# Altium schematic sheet down_converter_IF2.SchDoc: DOWN IF2
size A3; DocumentNumber: 17; Revision: 0; SheetNumber: 17; SheetTotal: 19
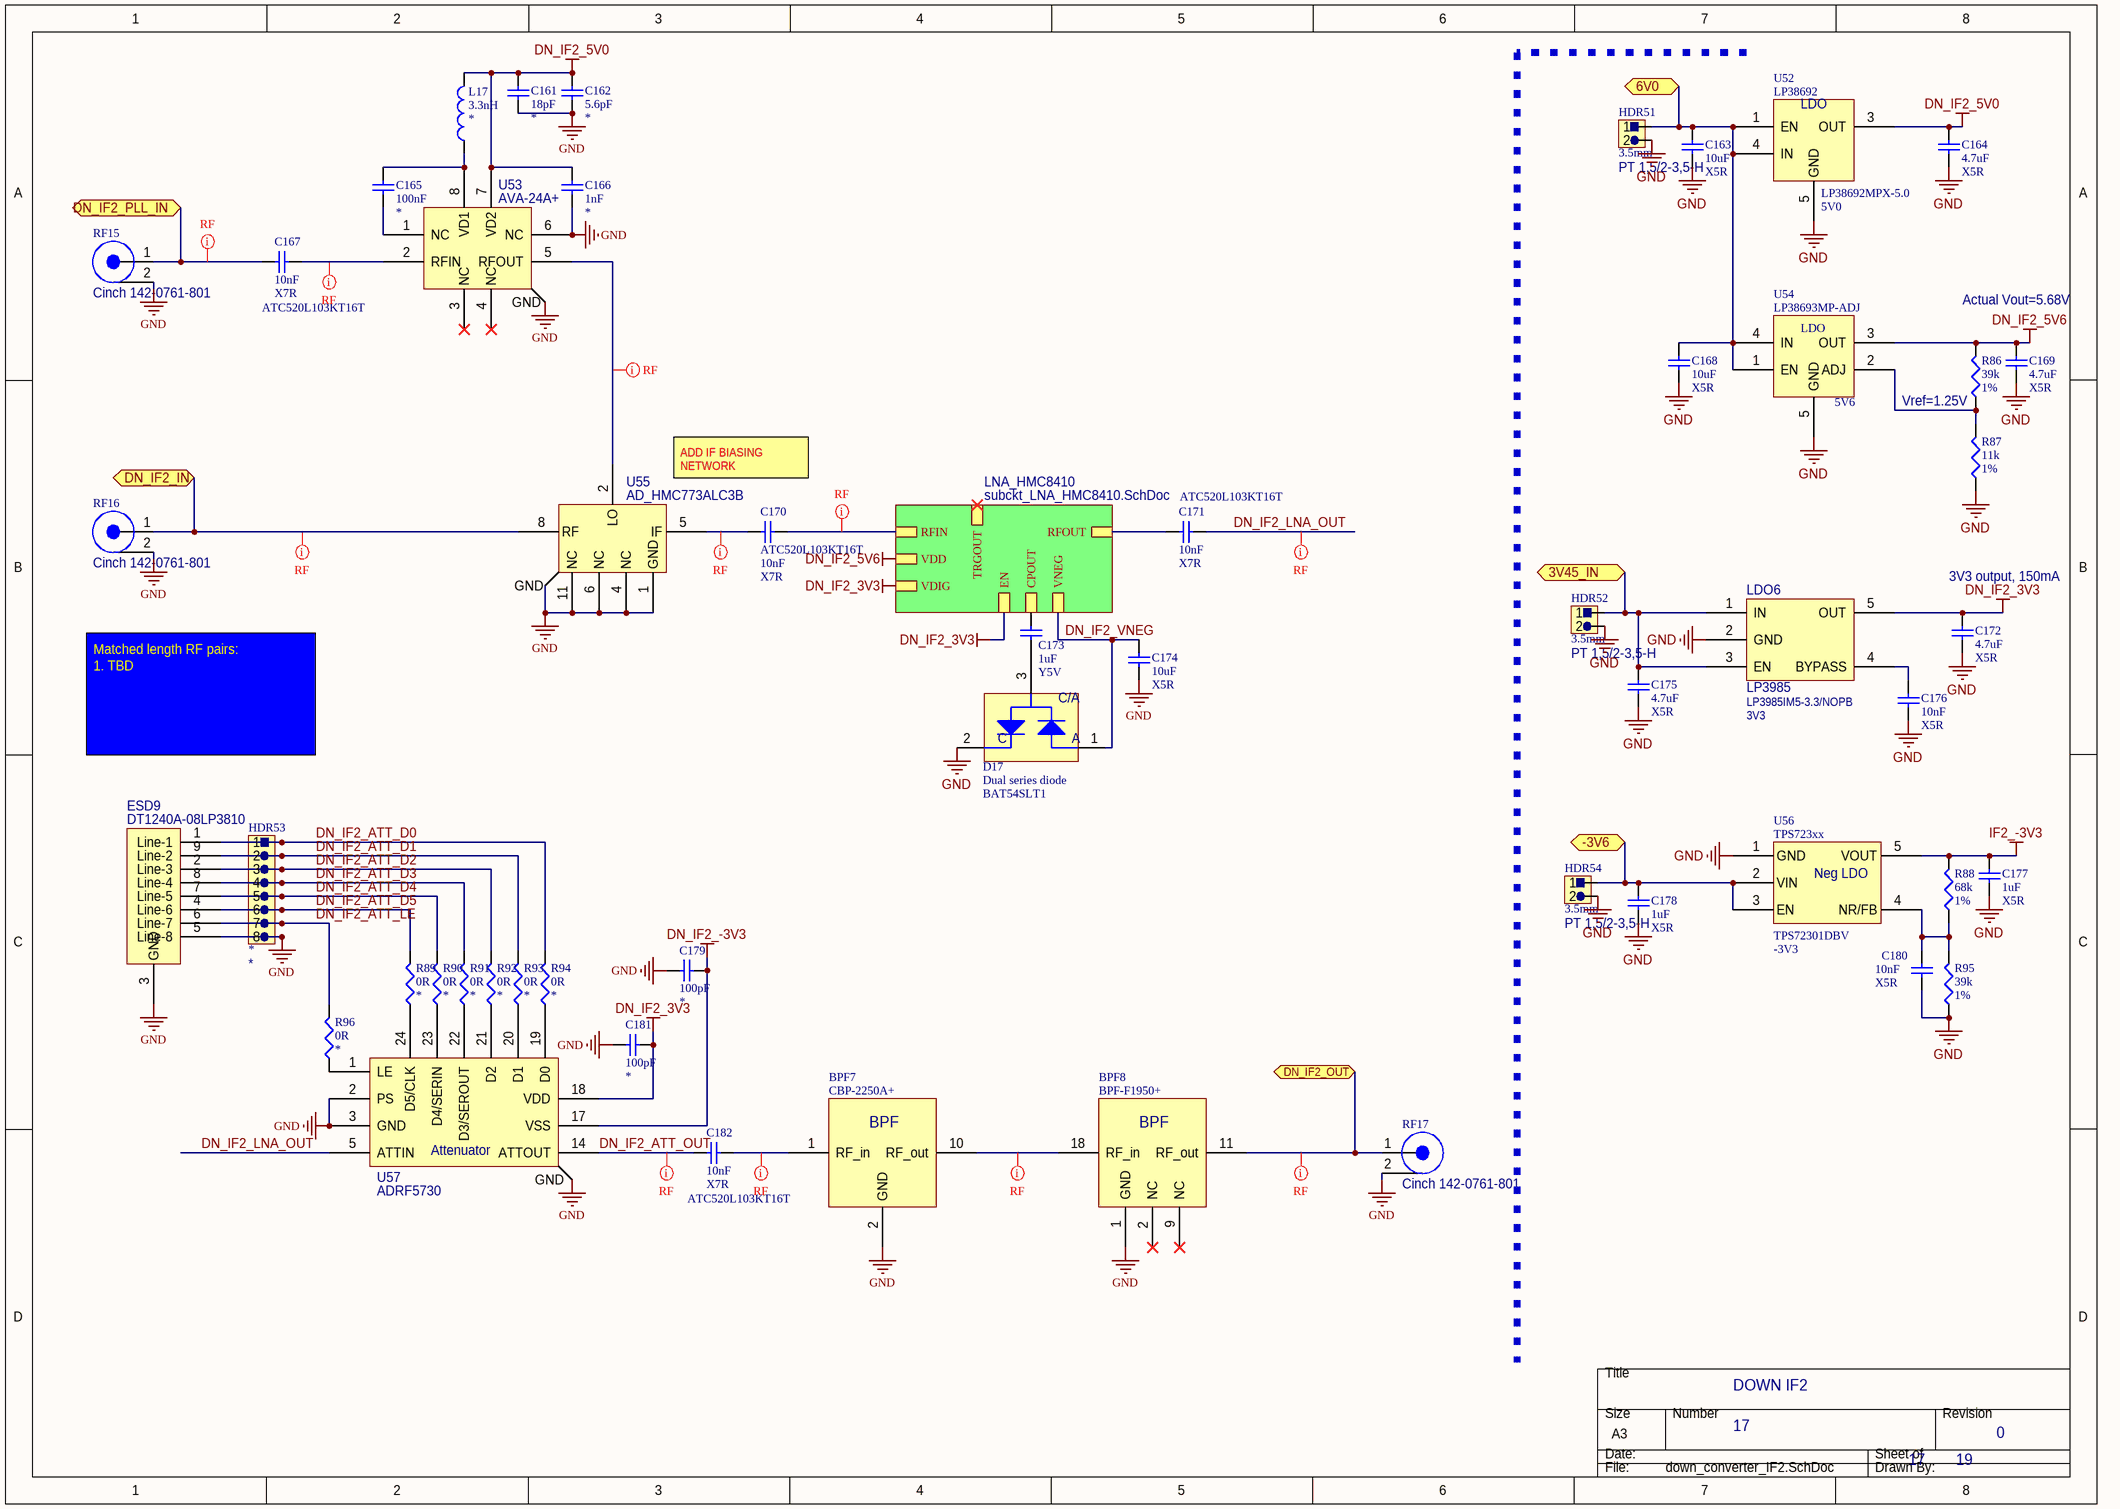
[diagram p0: down_converter_IF2.SchDoc]

## Parts
BPF7  CBP-2250A+
BPF8  BPF-F1950+
C161  value 18pF  [Model Name]  (hidden comment: Capacitor)
C162  value 5.6pF  [Model Name]  (hidden comment: Capacitor)
C163  value 10uF  Dielectric: X5R  [CAP0603]  (hidden comment: Capacitor)
C164  value 4.7uF  Dielectric: X5R  [TBD]  (hidden comment: Capacitor)
C165  value 100nF  [Model Name]  (hidden comment: Capacitor)
C166  value 1nF  [Model Name]  (hidden comment: Capacitor)
C167  ATC520L103KT16T  value 10nF  Dielectric: X7R  [TBD]
C168  value 10uF  Dielectric: X5R  [CAP0603]  (hidden comment: Capacitor)
C169  value 4.7uF  Dielectric: X5R  [CAP0603]  (hidden comment: Capacitor)
C170  ATC520L103KT16T  value 10nF  Dielectric: X7R  [TBD]
C171  ATC520L103KT16T  value 10nF  Dielectric: X7R  [TBD]
C172  value 4.7uF  Dielectric: X5R  [CAP0603]  (hidden comment: Capacitor)
C173  value 1uF  Dielectric: Y5V  [CAP0603]  (hidden comment: Capacitor)
C174  value 10uF  Dielectric: X5R  [CAP0603]  (hidden comment: Capacitor)
C175  value 4.7uF  Dielectric: X5R  [CAP0603]  (hidden comment: Capacitor)
C176  value 10nF  Dielectric: X5R  [CAP0603]  (hidden comment: Capacitor)
C177  value 1uF  Dielectric: X5R  [TBD]  (hidden comment: Capacitor)
C178  value 1uF  Dielectric: X5R  [CAP0603]  (hidden comment: Capacitor)
C179  value 100pF  [TBD]  (hidden comment: Capacitor)
C180  value 10nF  Dielectric: X5R  [TBD]  (hidden comment: Capacitor)
C181  value 100pF  [TBD]  (hidden comment: Capacitor)
C182  ATC520L103KT16T  value 10nF  Dielectric: X7R  [TBD]
D17  Dual series diode  Model: BAT54SLT1  [SOT23-3]
ESD9  DT1240A-08LP3810
HDR51  Pitch: 3.5mm  Model: PT 1,5/2-3,5-H  [JST ZH 2pin TH]  (hidden comment: Header 2 pins)
HDR52  Pitch: 3.5mm  Model: PT 1,5/2-3,5-H  [JST ZH 2pin TH]  (hidden comment: Header 2 pins)
HDR53  Header 8 pins  [TBD]  (value not drawn)
HDR54  Pitch: 3.5mm  Model: PT 1,5/2-3,5-H  [JST ZH 2pin TH]  (hidden comment: Header 2 pins)
L17  value 3.3nH  [TBD]  (hidden comment: Inductor)
LDO6  LP3985  Model: LP3985IM5-3.3/NOPB  Voltage: 3V3
R86  value 39k  Type: 1%  [RES0603]  (hidden comment: Resistor)
R87  value 11k  Type: 1%  [RES0603]  (hidden comment: Resistor)
R88  value 68k  Type: 1%  [RES0603]  (hidden comment: Resistor)
R89  value 0R  [RES0603]  (hidden comment: Resistor)
R90  value 0R  [RES0603]  (hidden comment: Resistor)
R91  value 0R  [RES0603]  (hidden comment: Resistor)
R92  value 0R  [RES0603]  (hidden comment: Resistor)
R93  value 0R  [RES0603]  (hidden comment: Resistor)
R94  value 0R  [RES0603]  (hidden comment: Resistor)
R95  value 39k  Type: 1%  [RES0603]  (hidden comment: Resistor)
R96  value 0R  [RES0603]  (hidden comment: Resistor)
RF15  Model: Cinch 142-0761-801  [TBD]  (hidden comment: RF connector w/ 2 pins)
RF16  Model: Cinch 142-0761-801  [TBD]  (hidden comment: RF connector w/ 2 pins)
RF17  Model: Cinch 142-0761-801  [TBD]  (hidden comment: RF connector w/ 2 pins)
U52  LP38692  Model: LP38692MPX-5.0  Voltage: 5V0  [TBD]
U53  AVA-24A+
U54  LDO  Model: LP38693MP-ADJ  Voltage: 5V6  [Model Name]
U55  AD_HMC773ALC3B
U56  TPS723xx  Model: TPS72301DBV  Voltage: -3V3  [TBD]
U57  ADRF5730

## Sub-sheets
LNA_HMC8410 = subckt_LNA_HMC8410.SchDoc: RFOUT, RFIN, VDD, EN, VDIG, CPOUT, VNEG, TRGOUT

## Ports
3V45_IN, 6V0, -3V6, DN_IF2_IN, DN_IF2_OUT, DN_IF2_PLL_IN

## Nets
DN_IF2_3V3: C172.2 C181.1 LDO6.5(OUT) U57.18(VDD) ; sheet LNA_HMC8410/EN, sheet LNA_HMC8410/VDIG
DN_IF2_5V0: C161.1 C162.1 C164.2 C166.1 L17.2 U52.3(OUT) U53.7(VD2)
DN_IF2_5V6: C169.2 R86.2 U54.3(OUT) ; sheet LNA_HMC8410/VDD
DN_IF2_-3V3: C179.1 U57.17(VSS)
GND: BPF7.2(GND) BPF7.3 BPF7.4 BPF7.5 BPF7.6 BPF7.7 BPF7.8 BPF7.9 BPF7.11 BPF7.12 BPF7.13 BPF7.14 BPF7.15 BPF7.16 BPF8.1(GND) BPF8.3 BPF8.4 BPF8.5 BPF8.6 BPF8.7 BPF8.8 BPF8.10 BPF8.12 BPF8.13 BPF8.14 BPF8.15 BPF8.16 BPF8.17 C161.2 C162.2 C163.1 C164.1 C166.2 C168.1 C169.1 C172.1 C174.1 C175.1 C176.1 C177.1 C178.1 C179.2 C180.1 C181.2 D17.2(C) ESD9.3(GND) ESD9.5(Line-8) HDR51.2 HDR52.2 HDR53.8 HDR54.2 LDO6.2(GND) R87.1 R95.1 RF15.2 RF16.2 RF17.2 U52.5(GND) U53.6(NC) U53.9(GND) U54.5(GND) U55.1(GND) U55.3(GND) U55.4(NC) U55.6(NC) U55.7(GND) U55.9(GND) U55.10(GND) U55.11(NC) U55.12(GND) U55.13(GND) U56.1(GND) U57.2(PS) U57.3(GND) U57.4(GND) U57.6(GND) U57.7(GND) U57.8(GND) U57.9(GND) U57.10(GND) U57.11(GND) U57.12(GND) U57.13(GND) U57.15(GND) U57.16(GND) U57.25(GND)
IF2_-3V3: C177.2 R88.2 U56.5(VOUT)
3V45_IN: C175.2 HDR52.1 LDO6.1(IN) LDO6.3(EN) ; port 3V45_IN
6V0: C163.2 C168.2 HDR51.1 U52.1(EN) U52.4(IN) U54.1(EN) U54.4(IN) ; port 6V0
-3V6: C178.2 HDR54.1 U56.2(VIN) U56.3(EN) ; port -3V6
DN_IF2_ATT_D0: ESD9.1(Line-1) HDR53.1 R94.2
DN_IF2_ATT_D1: ESD9.9(Line-2) HDR53.2 R93.2
DN_IF2_ATT_D2: ESD9.2(Line-3) HDR53.3 R92.2
DN_IF2_ATT_D3: ESD9.8(Line-4) HDR53.4 R91.2
DN_IF2_ATT_D4: ESD9.7(Line-5) HDR53.5 R90.2
DN_IF2_ATT_D5: ESD9.4(Line-6) HDR53.6 R89.2
DN_IF2_ATT_LE: ESD9.6(Line-7) HDR53.7 R96.2
DN_IF2_ATT_OUT: C182.1 U57.14(ATTOUT)
DN_IF2_IN: RF16.1 U55.8(RF) ; port DN_IF2_IN
DN_IF2_LNA_OUT: C171.2 U57.5(ATTIN)
DN_IF2_OUT: BPF8.11(RF_out) RF17.1 ; port DN_IF2_OUT
DN_IF2_PLL_IN: C167.1 RF15.1 ; port DN_IF2_PLL_IN
DN_IF2_VNEG: C174.2 D17.1(A) ; sheet LNA_HMC8410/VNEG
NetBPF7_1: BPF7.1(RF_in) C182.2
NetBPF7_10: BPF7.10(RF_out) BPF8.18(RF_in)
NetC165_1: C165.1 L17.1 U53.8(VD1)
NetC165_2: C165.2 U53.1(NC)
NetC167_2: C167.2 U53.2(RFIN)
NetC170_1: C170.1 U55.5(IF)
NetC170_2: C170.2 ; sheet LNA_HMC8410/RFIN
NetC171_1: C171.1 ; sheet LNA_HMC8410/RFOUT
NetC173_1: C173.1 D17.3(C/A)
NetC173_2: C173.2 ; sheet LNA_HMC8410/CPOUT
NetC176_2: C176.2 LDO6.4(BYPASS)
NetC180_2: C180.2 R88.1 R95.2 U56.4(NR/FB)
NetR86_1: R86.1 R87.2 U54.2(ADJ)
NetR89_1: R89.1 U57.24(D5/CLK)
NetR90_1: R90.1 U57.23(D4/SERIN)
NetR91_1: R91.1 U57.22(D3/SEROUT)
NetR92_1: R92.1 U57.21(D2)
NetR93_1: R93.1 U57.20(D1)
NetR94_1: R94.1 U57.19(D0)
NetR96_1: R96.1 U57.1(LE)
NetU53_5: U53.5(RFOUT) U55.2(LO)

Not connected (* = marked no-connect by the designer): BPF8 2(NC)* 9(NC)*; U52 2(NC); U53 3(NC)* 4(NC)*

## Layout directives
net class RF: DN_IF2_ATT_OUT, DN_IF2_IN, DN_IF2_LNA_OUT, DN_IF2_OUT, DN_IF2_PLL_IN, NetBPF7_1, NetBPF7_10, NetC167_2, NetC170_1, NetC170_2, NetU53_5

## Notes on the sheet
- Actual Vout=5.68V
- (near R86) Vref=1.25V
- (near U55) ADD IF BIASING NETWORK
- (near C172) 3V3 output, 150mA
- Matched length RF pairs:
  1. TBD
- (in symbol AD_ADRF5730) Attenuator
- (in symbol LP38692) LDO
- (in symbol minicircuits_BPF-F1950+) BPF
- (in symbol minicircuits_CBP-2250A+) BPF
- (in symbol TPS723xx) Neg LDO

## Library data of the parts
BPF7 = minicircuits_CBP-2250A+: Mini-Circuits band pass filter 2000-2500 MHz
BPF8 = minicircuits_BPF-F1950+: Mini-Circuits band pass filter 1450-2450MHz
C167 C170 C171 C182 = Capacitor
D17 = D dual series diode
ESD9 = DiodesInc_DT1240A-08LP3810: Diodes Incorporated 8ch 3.3V ESD diodes
HDR51 HDR52 HDR54 = Header2
HDR53 = Header8: Pitch: *; Model: *
LDO6 = LP3985: LDO 150mA
RF15-RF17 = RF_connector: RF connector w/  pin and barrel
U52 = LP38692: LDO LP38692
U53 = Minicircuits_AVA-24A+: Minicircuits amplifier AVA-24A+ 5GHz-20GHz
U54 = LDO_Adj: Adjustable LDO
U55 = AD_HMC773ALC3B: AD mixer HMC773ALC3B, 6GHz - 26GHz
U56 = TPS723xx: Adjustable negative voltage LDO
U57 = AD_ADRF5730: AD Attenuator, 0.5dB LSB, ADRF5730
C161-C166 C168 C169 C172-C181 = Capacitor
  C161 C162 C165 C166 C179 C181: Dielectric: *
L17 = Inductor: Model: *
R86-R96 = Resistor
  R89-R94 R96: Type: *